# Altium schematic sheet PIR Sensor driver.SchDoc
size A4
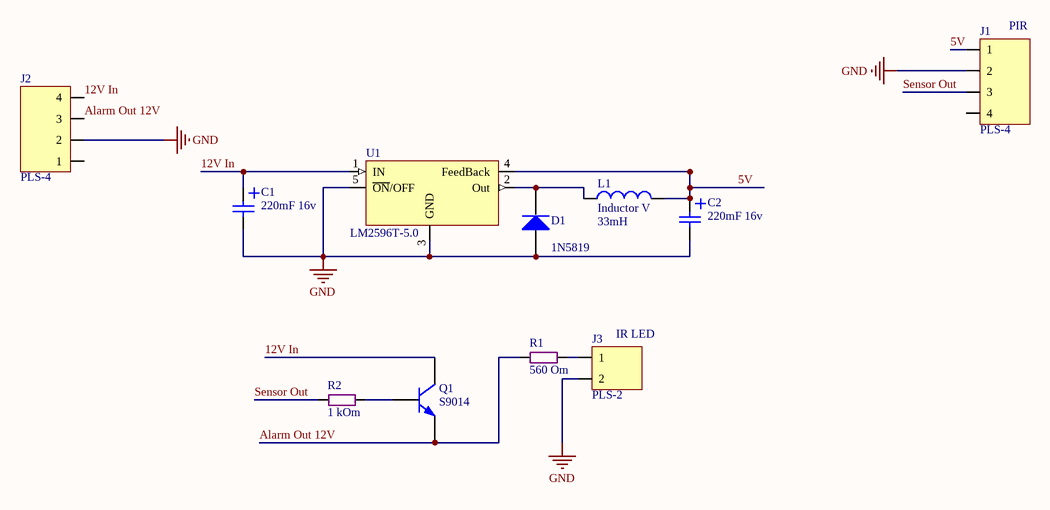
[diagram p0: PIR Sensor driver.SchDoc]

## Parts
C1  220mF 16v  [Cap E p2mm D6.5xH11]
C2  220mF 16v  [Cap E p2mm D6.5xH11]
D1  1N5819  [Diode DO-35]
J1  PLS-4  [Line 2.54 X 4]
J2  PLS-4  [Line 2.54 X 4]
J3  PLS-2  [Line 2.54 x 2]
L1  Inductor V  value 33mH  [Toroid V D14-W6]
Q1  S9014  [TO-92 2.54 (EBC)]
R1  560 Om  [Res p7.62 (4p) 0.25w]
R2  1 kOm  [Res p7.62 (4p) 0.25w]
U1  LM2596T-5.0  [TO220-5 Horisontal]

## Nets
GND: C1.2 C2.2 D1.A J1.2 J2.2 J3.2 U1.3(GND) U1.5(~{ON}/OFF)
5V: C2.1 J1.1 L1.2 U1.4(FeedBack)
12V In: C1.1 J2.4 Q1.C U1.1(IN)
Alarm Out 12V: J2.3 Q1.E R1.1
Sensor Out: J1.3 R2.1
NetD1_K: D1.K L1.1 U1.2(Out)
NetJ3_1: J3.1 R1.2
NetQ1_B: Q1.B R2.2

Not connected (* = marked no-connect by the designer): J1 4; J2 1

## Notes on the sheet
- (near J1) PIR
- (near J3) IR LED

## Library data of the parts
C1 C2 = Cap E 220mF x 16V: Capacitor; Value: 220mF 16v
D1 = Diode 1N5819: 1 Amp General Purpose Rectifier; PackageReference: DO-41; VALUE: 1N5819
J1 J2 = PLS-4: Vert, Sgl line, Male
J3 = PLS-2: Vert, Sgl line, Male
L1 = Inductor V: Inductor Vertical; Code_IEC: 1005; Published: 8-Jun-2000; LatestRevisionDate: 29-May-2009; LatestRevisionNote: IPC-7351 Footprint Added.; PackageReference: 0402-A; Publisher: Altium Limited; PackageDescription: Chip Inductor; Code_JEITA: 0402
Q1 = S9014: NPN Bipolar Transistor; Published: 8-Jun-2000; LatestRevisionNote: Re-released for DXP Platform.; PackageReference: TO-226-AA; Publisher: Altium Limited; PackageDescription: TO, Flat Index; 3 In-Line, Axial Leads; Body Dia. 4.8mm; Leads 0.55 x 0.51 mm (max)
R1 R2 = Res Carbon
U1 = LM2596T-5.0: Voltage Regulator; Manufacturer: National Semiconductor; I output (A): 3; Max Voltage In (V): 40; Name: LM2596T-5.0; Case: TO220-5